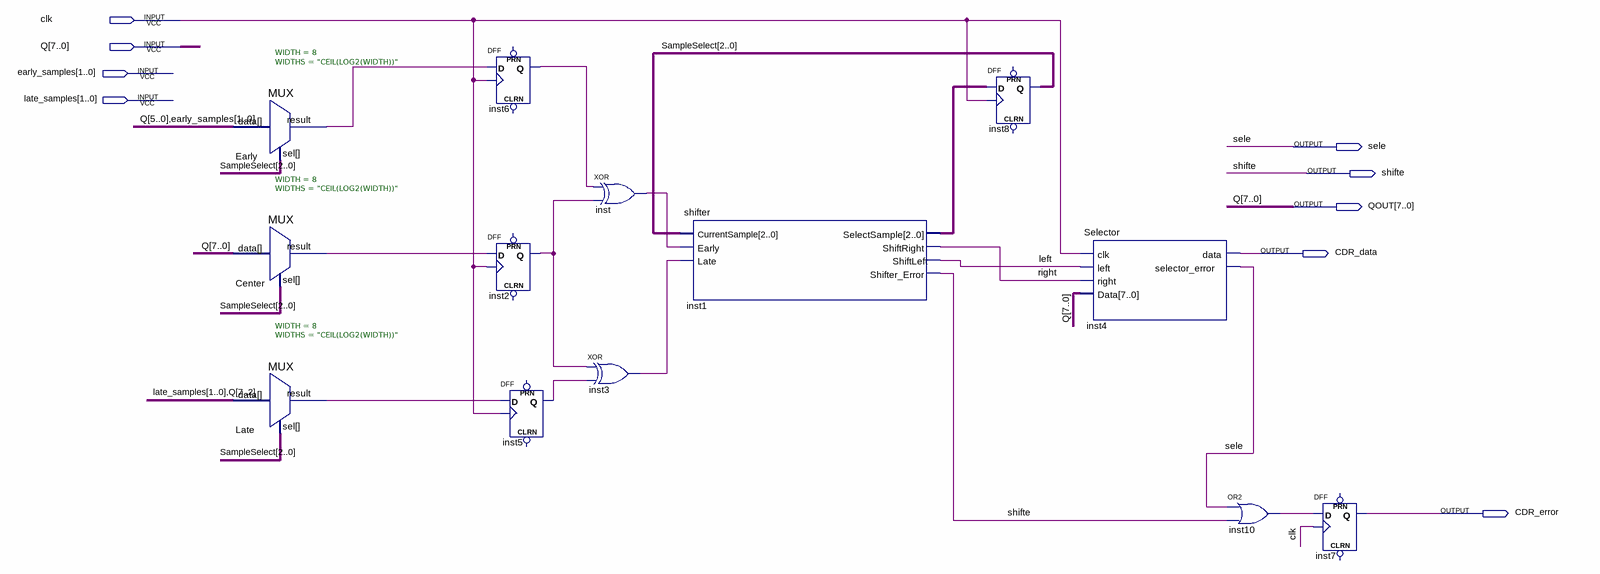
[diagram p0: schematic sheet]
// Quartus schematic DESER_CDR.bdf as structural Verilog: 13 symbols, 9 pins
module DESER_CDR (
  input  clk,
  input  [7:0] Q,
  input  [1:0] early_samples,
  input  [1:0] late_samples,
  output sele,
  output shifte,
  output [7:0] QOUT,
  output CDR_data,
  output CDR_error
);

  wire Center_result, Early_result, inst2_q, inst3_out, inst5_q, inst6_q, inst10_out, inst_out, Late_result,
       left, right;
  wire [2:0] inst1_selectsample, SampleSelect;

  MUX #(.WIDTH(8), .WIDTHS("CEIL(LOG2(WIDTH))")) Early (
    .data({Q[5:0], early_samples}), .sel(SampleSelect), .result(Early_result));
  MUX #(.WIDTH(8), .WIDTHS("CEIL(LOG2(WIDTH))")) Center (.data(Q), .sel(SampleSelect), .result(Center_result));
  MUX #(.WIDTH(8), .WIDTHS("CEIL(LOG2(WIDTH))")) Late (
    .data({late_samples, Q[7:2]}), .sel(SampleSelect), .result(Late_result));
  DFF inst6 (.CLK(clk), .D(Early_result), .Q(inst6_q));  // open: CLRN, PRN
  DFF inst2 (.CLK(clk), .D(Center_result), .Q(inst2_q));  // open: CLRN, PRN
  DFF inst5 (.CLK(clk), .D(Late_result), .Q(inst5_q));  // open: CLRN, PRN
  xor inst (inst_out, inst6_q, inst2_q);
  xor inst3 (inst3_out, inst2_q, inst5_q);
  shifter inst1 (
    .CurrentSample(SampleSelect), .Early(inst_out), .Late(inst3_out), .SelectSample(inst1_selectsample),
    .ShiftRight(right), .ShiftLeft(left), .Shifter_Error(shifte));
  DFF inst8[2:0] (.CLK(clk), .D(inst1_selectsample), .Q(SampleSelect));  // open: CLRN, PRN
  Selector inst4 (.clk(clk), .left(left), .right(right), .Data(Q), .data(CDR_data), .selector_error(sele));
  or inst10 (inst10_out, sele, shifte);
  DFF inst7 (.CLK(clk), .D(inst10_out), .Q(CDR_error));  // open: CLRN, PRN

  assign QOUT = Q;
endmodule
